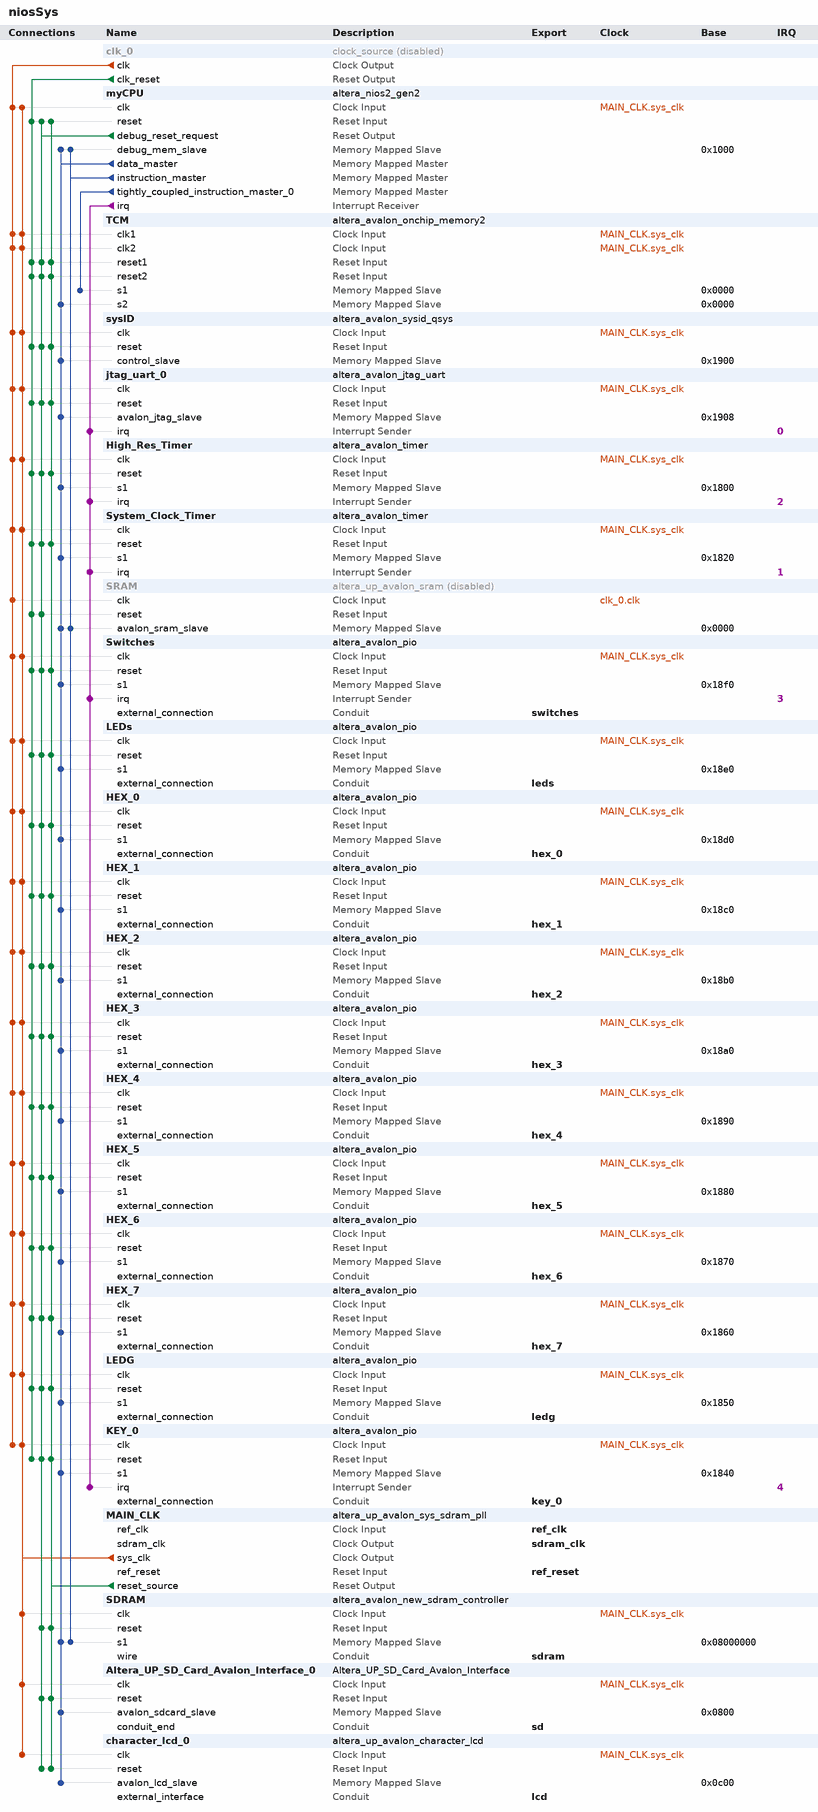
[diagram p0: system contents]
# Platform Designer (Qsys) system niosSys, Cyclone IV E EP4CE115F29C7
# Parameters at their usual value, and those the tool derives, are not listed.
package require -exact qsys 16.1
create_system niosSys
set_project_property DEVICE_FAMILY {Cyclone IV E}
set_project_property DEVICE EP4CE115F29C7

add_instance clk_0 clock_source 16.1
set_instance_property clk_0 ENABLED false
set_instance_parameter_value clk_0 clockFrequency 50000000

add_instance myCPU altera_nios2_gen2 16.1
set_instance_parameter_value myCPU dcache_size 2048
set_instance_parameter_value myCPU exceptionSlave SDRAM.s1
set_instance_parameter_value myCPU icache_numTCIM 1
set_instance_parameter_value myCPU icache_size 4096
set_instance_parameter_value myCPU impl Fast
set_instance_parameter_value myCPU resetSlave SDRAM.s1

add_instance TCM altera_avalon_onchip_memory2 16.1
set_instance_parameter_value TCM dataWidth 32
set_instance_parameter_value TCM dualPort true
set_instance_parameter_value TCM enableDiffWidth true
set_instance_parameter_value TCM initMemContent true
set_instance_parameter_value TCM initializationFileName onchip_mem.hex
set_instance_parameter_value TCM memorySize 2048

add_instance sysID altera_avalon_sysid_qsys 16.1
set_instance_parameter_value sysID id 305419896

add_instance jtag_uart_0 altera_avalon_jtag_uart 16.1
set_instance_parameter_value jtag_uart_0 simInteractiveOptions NO_INTERACTIVE_WINDOWS

add_instance High_Res_Timer altera_avalon_timer 16.1
set_instance_parameter_value High_Res_Timer period 1
set_instance_parameter_value High_Res_Timer periodUnits MSEC

add_instance System_Clock_Timer altera_avalon_timer 16.1
set_instance_parameter_value System_Clock_Timer period 1
set_instance_parameter_value System_Clock_Timer periodUnits MSEC

add_instance SRAM altera_up_avalon_sram 16.1
set_instance_property SRAM ENABLED false
set_instance_parameter_value SRAM board DE2-115
set_instance_parameter_value SRAM pixel_buffer false

add_instance Switches altera_avalon_pio 16.1
set_instance_parameter_value Switches direction Input
set_instance_parameter_value Switches generateIRQ true
set_instance_parameter_value Switches width 18

add_instance LEDs altera_avalon_pio 16.1
set_instance_parameter_value LEDs direction Output
set_instance_parameter_value LEDs width 18

add_instance HEX_0 altera_avalon_pio 16.1
set_instance_parameter_value HEX_0 direction Output
set_instance_parameter_value HEX_0 width 7

add_instance HEX_1 altera_avalon_pio 16.1
set_instance_parameter_value HEX_1 direction Output
set_instance_parameter_value HEX_1 width 7

add_instance HEX_2 altera_avalon_pio 16.1
set_instance_parameter_value HEX_2 direction Output
set_instance_parameter_value HEX_2 width 7

add_instance HEX_3 altera_avalon_pio 16.1
set_instance_parameter_value HEX_3 direction Output
set_instance_parameter_value HEX_3 width 7

add_instance HEX_4 altera_avalon_pio 16.1
set_instance_parameter_value HEX_4 direction Output
set_instance_parameter_value HEX_4 width 7

add_instance HEX_5 altera_avalon_pio 16.1
set_instance_parameter_value HEX_5 direction Output
set_instance_parameter_value HEX_5 width 7

add_instance HEX_6 altera_avalon_pio 16.1
set_instance_parameter_value HEX_6 direction Output
set_instance_parameter_value HEX_6 width 7

add_instance HEX_7 altera_avalon_pio 16.1
set_instance_parameter_value HEX_7 direction Output
set_instance_parameter_value HEX_7 width 7

add_instance LEDG altera_avalon_pio 16.1
set_instance_parameter_value LEDG direction Output
set_instance_parameter_value LEDG width 8

add_instance KEY_0 altera_avalon_pio 16.1
set_instance_parameter_value KEY_0 captureEdge true
set_instance_parameter_value KEY_0 direction Input
set_instance_parameter_value KEY_0 edgeType FALLING
set_instance_parameter_value KEY_0 generateIRQ true
set_instance_parameter_value KEY_0 irqType EDGE
set_instance_parameter_value KEY_0 width 4

add_instance MAIN_CLK altera_up_avalon_sys_sdram_pll 16.1
set_instance_parameter_value MAIN_CLK CV_boards DE1-SoC
set_instance_parameter_value MAIN_CLK gui_outclk 50.0
set_instance_parameter_value MAIN_CLK gui_refclk 50.0

add_instance SDRAM altera_avalon_new_sdram_controller 16.1
set_instance_parameter_value SDRAM TAC 5.4
set_instance_parameter_value SDRAM TRCD 15.0
set_instance_parameter_value SDRAM TRP 15.0
set_instance_parameter_value SDRAM casLatency 3
set_instance_parameter_value SDRAM columnWidth 10
set_instance_parameter_value SDRAM dataWidth 32
set_instance_parameter_value SDRAM generateSimulationModel false
set_instance_parameter_value SDRAM model single_Micron_MT48LC4M32B2_7_chip
set_instance_parameter_value SDRAM numberOfBanks 4
set_instance_parameter_value SDRAM numberOfChipSelects 1
set_instance_parameter_value SDRAM powerUpDelay 100.0
set_instance_parameter_value SDRAM refreshPeriod 7.185
set_instance_parameter_value SDRAM rowWidth 13

add_instance Altera_UP_SD_Card_Avalon_Interface_0 Altera_UP_SD_Card_Avalon_Interface 16.1

add_instance character_lcd_0 altera_up_avalon_character_lcd 16.1
set_instance_parameter_value character_lcd_0 cursor Blinking

# connections
add_connection clk_0.clk HEX_0.clk clock
add_connection clk_0.clk HEX_1.clk clock
add_connection clk_0.clk HEX_2.clk clock
add_connection clk_0.clk HEX_3.clk clock
add_connection clk_0.clk HEX_4.clk clock
add_connection clk_0.clk HEX_5.clk clock
add_connection clk_0.clk HEX_6.clk clock
add_connection clk_0.clk HEX_7.clk clock
add_connection clk_0.clk High_Res_Timer.clk clock
add_connection clk_0.clk jtag_uart_0.clk clock
add_connection clk_0.clk KEY_0.clk clock
add_connection clk_0.clk LEDG.clk clock
add_connection clk_0.clk LEDs.clk clock
add_connection clk_0.clk myCPU.clk clock
add_connection clk_0.clk SRAM.clk clock
add_connection clk_0.clk Switches.clk clock
add_connection clk_0.clk sysID.clk clock
add_connection clk_0.clk System_Clock_Timer.clk clock
add_connection clk_0.clk TCM.clk1 clock
add_connection clk_0.clk TCM.clk2 clock
add_connection MAIN_CLK.sys_clk Altera_UP_SD_Card_Avalon_Interface_0.clk clock
add_connection MAIN_CLK.sys_clk character_lcd_0.clk clock
add_connection MAIN_CLK.sys_clk HEX_0.clk clock
add_connection MAIN_CLK.sys_clk HEX_1.clk clock
add_connection MAIN_CLK.sys_clk HEX_2.clk clock
add_connection MAIN_CLK.sys_clk HEX_3.clk clock
add_connection MAIN_CLK.sys_clk HEX_4.clk clock
add_connection MAIN_CLK.sys_clk HEX_5.clk clock
add_connection MAIN_CLK.sys_clk HEX_6.clk clock
add_connection MAIN_CLK.sys_clk HEX_7.clk clock
add_connection MAIN_CLK.sys_clk High_Res_Timer.clk clock
add_connection MAIN_CLK.sys_clk jtag_uart_0.clk clock
add_connection MAIN_CLK.sys_clk KEY_0.clk clock
add_connection MAIN_CLK.sys_clk LEDG.clk clock
add_connection MAIN_CLK.sys_clk LEDs.clk clock
add_connection MAIN_CLK.sys_clk myCPU.clk clock
add_connection MAIN_CLK.sys_clk SDRAM.clk clock
add_connection MAIN_CLK.sys_clk Switches.clk clock
add_connection MAIN_CLK.sys_clk sysID.clk clock
add_connection MAIN_CLK.sys_clk System_Clock_Timer.clk clock
add_connection MAIN_CLK.sys_clk TCM.clk1 clock
add_connection MAIN_CLK.sys_clk TCM.clk2 clock
add_connection clk_0.clk_reset HEX_0.reset reset
add_connection clk_0.clk_reset HEX_1.reset reset
add_connection clk_0.clk_reset HEX_2.reset reset
add_connection clk_0.clk_reset HEX_3.reset reset
add_connection clk_0.clk_reset HEX_4.reset reset
add_connection clk_0.clk_reset HEX_5.reset reset
add_connection clk_0.clk_reset HEX_6.reset reset
add_connection clk_0.clk_reset HEX_7.reset reset
add_connection clk_0.clk_reset High_Res_Timer.reset reset
add_connection clk_0.clk_reset jtag_uart_0.reset reset
add_connection clk_0.clk_reset KEY_0.reset reset
add_connection clk_0.clk_reset LEDG.reset reset
add_connection clk_0.clk_reset LEDs.reset reset
add_connection clk_0.clk_reset myCPU.reset reset
add_connection clk_0.clk_reset SRAM.reset reset
add_connection clk_0.clk_reset Switches.reset reset
add_connection clk_0.clk_reset sysID.reset reset
add_connection clk_0.clk_reset System_Clock_Timer.reset reset
add_connection clk_0.clk_reset TCM.reset1 reset
add_connection clk_0.clk_reset TCM.reset2 reset
add_connection MAIN_CLK.reset_source Altera_UP_SD_Card_Avalon_Interface_0.reset reset
add_connection MAIN_CLK.reset_source character_lcd_0.reset reset
add_connection MAIN_CLK.reset_source HEX_0.reset reset
add_connection MAIN_CLK.reset_source HEX_1.reset reset
add_connection MAIN_CLK.reset_source HEX_2.reset reset
add_connection MAIN_CLK.reset_source HEX_3.reset reset
add_connection MAIN_CLK.reset_source HEX_4.reset reset
add_connection MAIN_CLK.reset_source HEX_5.reset reset
add_connection MAIN_CLK.reset_source HEX_6.reset reset
add_connection MAIN_CLK.reset_source HEX_7.reset reset
add_connection MAIN_CLK.reset_source High_Res_Timer.reset reset
add_connection MAIN_CLK.reset_source jtag_uart_0.reset reset
add_connection MAIN_CLK.reset_source KEY_0.reset reset
add_connection MAIN_CLK.reset_source LEDG.reset reset
add_connection MAIN_CLK.reset_source LEDs.reset reset
add_connection MAIN_CLK.reset_source myCPU.reset reset
add_connection MAIN_CLK.reset_source SDRAM.reset reset
add_connection MAIN_CLK.reset_source Switches.reset reset
add_connection MAIN_CLK.reset_source sysID.reset reset
add_connection MAIN_CLK.reset_source System_Clock_Timer.reset reset
add_connection MAIN_CLK.reset_source TCM.reset1 reset
add_connection MAIN_CLK.reset_source TCM.reset2 reset
add_connection myCPU.debug_reset_request Altera_UP_SD_Card_Avalon_Interface_0.reset reset
add_connection myCPU.debug_reset_request character_lcd_0.reset reset
add_connection myCPU.debug_reset_request HEX_0.reset reset
add_connection myCPU.debug_reset_request HEX_1.reset reset
add_connection myCPU.debug_reset_request HEX_2.reset reset
add_connection myCPU.debug_reset_request HEX_3.reset reset
add_connection myCPU.debug_reset_request HEX_4.reset reset
add_connection myCPU.debug_reset_request HEX_5.reset reset
add_connection myCPU.debug_reset_request HEX_6.reset reset
add_connection myCPU.debug_reset_request HEX_7.reset reset
add_connection myCPU.debug_reset_request High_Res_Timer.reset reset
add_connection myCPU.debug_reset_request jtag_uart_0.reset reset
add_connection myCPU.debug_reset_request KEY_0.reset reset
add_connection myCPU.debug_reset_request LEDG.reset reset
add_connection myCPU.debug_reset_request LEDs.reset reset
add_connection myCPU.debug_reset_request myCPU.reset reset
add_connection myCPU.debug_reset_request SDRAM.reset reset
add_connection myCPU.debug_reset_request SRAM.reset reset
add_connection myCPU.debug_reset_request Switches.reset reset
add_connection myCPU.debug_reset_request sysID.reset reset
add_connection myCPU.debug_reset_request System_Clock_Timer.reset reset
add_connection myCPU.debug_reset_request TCM.reset1 reset
add_connection myCPU.debug_reset_request TCM.reset2 reset
add_connection myCPU.data_master Altera_UP_SD_Card_Avalon_Interface_0.avalon_sdcard_slave avalon
set_connection_parameter_value myCPU.data_master/Altera_UP_SD_Card_Avalon_Interface_0.avalon_sdcard_slave baseAddress 0x0800
add_connection myCPU.data_master character_lcd_0.avalon_lcd_slave avalon
set_connection_parameter_value myCPU.data_master/character_lcd_0.avalon_lcd_slave baseAddress 0x0c00
add_connection myCPU.data_master HEX_0.s1 avalon
set_connection_parameter_value myCPU.data_master/HEX_0.s1 baseAddress 0x18d0
add_connection myCPU.data_master HEX_1.s1 avalon
set_connection_parameter_value myCPU.data_master/HEX_1.s1 baseAddress 0x18c0
add_connection myCPU.data_master HEX_2.s1 avalon
set_connection_parameter_value myCPU.data_master/HEX_2.s1 baseAddress 0x18b0
add_connection myCPU.data_master HEX_3.s1 avalon
set_connection_parameter_value myCPU.data_master/HEX_3.s1 baseAddress 0x18a0
add_connection myCPU.data_master HEX_4.s1 avalon
set_connection_parameter_value myCPU.data_master/HEX_4.s1 baseAddress 0x1890
add_connection myCPU.data_master HEX_5.s1 avalon
set_connection_parameter_value myCPU.data_master/HEX_5.s1 baseAddress 0x1880
add_connection myCPU.data_master HEX_6.s1 avalon
set_connection_parameter_value myCPU.data_master/HEX_6.s1 baseAddress 0x1870
add_connection myCPU.data_master HEX_7.s1 avalon
set_connection_parameter_value myCPU.data_master/HEX_7.s1 baseAddress 0x1860
add_connection myCPU.data_master High_Res_Timer.s1 avalon
set_connection_parameter_value myCPU.data_master/High_Res_Timer.s1 baseAddress 0x1800
add_connection myCPU.data_master jtag_uart_0.avalon_jtag_slave avalon
set_connection_parameter_value myCPU.data_master/jtag_uart_0.avalon_jtag_slave baseAddress 0x1908
add_connection myCPU.data_master KEY_0.s1 avalon
set_connection_parameter_value myCPU.data_master/KEY_0.s1 baseAddress 0x1840
add_connection myCPU.data_master LEDG.s1 avalon
set_connection_parameter_value myCPU.data_master/LEDG.s1 baseAddress 0x1850
add_connection myCPU.data_master LEDs.s1 avalon
set_connection_parameter_value myCPU.data_master/LEDs.s1 baseAddress 0x18e0
add_connection myCPU.data_master myCPU.debug_mem_slave avalon
set_connection_parameter_value myCPU.data_master/myCPU.debug_mem_slave baseAddress 0x1000
add_connection myCPU.data_master SDRAM.s1 avalon
set_connection_parameter_value myCPU.data_master/SDRAM.s1 baseAddress 0x08000000
add_connection myCPU.data_master SRAM.avalon_sram_slave avalon
set_connection_parameter_value myCPU.data_master/SRAM.avalon_sram_slave baseAddress 0x0000
add_connection myCPU.data_master Switches.s1 avalon
set_connection_parameter_value myCPU.data_master/Switches.s1 baseAddress 0x18f0
add_connection myCPU.data_master sysID.control_slave avalon
set_connection_parameter_value myCPU.data_master/sysID.control_slave baseAddress 0x1900
add_connection myCPU.data_master System_Clock_Timer.s1 avalon
set_connection_parameter_value myCPU.data_master/System_Clock_Timer.s1 baseAddress 0x1820
add_connection myCPU.data_master TCM.s2 avalon
set_connection_parameter_value myCPU.data_master/TCM.s2 baseAddress 0x0000
add_connection myCPU.instruction_master myCPU.debug_mem_slave avalon
set_connection_parameter_value myCPU.instruction_master/myCPU.debug_mem_slave baseAddress 0x1000
add_connection myCPU.instruction_master SDRAM.s1 avalon
set_connection_parameter_value myCPU.instruction_master/SDRAM.s1 baseAddress 0x08000000
add_connection myCPU.instruction_master SRAM.avalon_sram_slave avalon
set_connection_parameter_value myCPU.instruction_master/SRAM.avalon_sram_slave baseAddress 0x0000
add_connection myCPU.tightly_coupled_instruction_master_0 TCM.s1 avalon
set_connection_parameter_value myCPU.tightly_coupled_instruction_master_0/TCM.s1 baseAddress 0x0000
add_connection myCPU.irq High_Res_Timer.irq interrupt
set_connection_parameter_value myCPU.irq/High_Res_Timer.irq irqNumber 2
add_connection myCPU.irq jtag_uart_0.irq interrupt
set_connection_parameter_value myCPU.irq/jtag_uart_0.irq irqNumber 0
add_connection myCPU.irq KEY_0.irq interrupt
set_connection_parameter_value myCPU.irq/KEY_0.irq irqNumber 4
add_connection myCPU.irq Switches.irq interrupt
set_connection_parameter_value myCPU.irq/Switches.irq irqNumber 3
add_connection myCPU.irq System_Clock_Timer.irq interrupt
set_connection_parameter_value myCPU.irq/System_Clock_Timer.irq irqNumber 1

# exported interfaces
add_interface hex_0 conduit end
set_interface_property hex_0 EXPORT_OF HEX_0.external_connection
add_interface hex_1 conduit end
set_interface_property hex_1 EXPORT_OF HEX_1.external_connection
add_interface hex_2 conduit end
set_interface_property hex_2 EXPORT_OF HEX_2.external_connection
add_interface hex_3 conduit end
set_interface_property hex_3 EXPORT_OF HEX_3.external_connection
add_interface hex_4 conduit end
set_interface_property hex_4 EXPORT_OF HEX_4.external_connection
add_interface hex_5 conduit end
set_interface_property hex_5 EXPORT_OF HEX_5.external_connection
add_interface hex_6 conduit end
set_interface_property hex_6 EXPORT_OF HEX_6.external_connection
add_interface hex_7 conduit end
set_interface_property hex_7 EXPORT_OF HEX_7.external_connection
add_interface key_0 conduit end
set_interface_property key_0 EXPORT_OF KEY_0.external_connection
add_interface lcd conduit end
set_interface_property lcd EXPORT_OF character_lcd_0.external_interface
add_interface ledg conduit end
set_interface_property ledg EXPORT_OF LEDG.external_connection
add_interface leds conduit end
set_interface_property leds EXPORT_OF LEDs.external_connection
add_interface ref_clk clock sink
set_interface_property ref_clk EXPORT_OF MAIN_CLK.ref_clk
add_interface ref_reset reset sink
set_interface_property ref_reset EXPORT_OF MAIN_CLK.ref_reset
add_interface sd conduit end
set_interface_property sd EXPORT_OF Altera_UP_SD_Card_Avalon_Interface_0.conduit_end
add_interface sdram conduit end
set_interface_property sdram EXPORT_OF SDRAM.wire
add_interface sdram_clk clock source
set_interface_property sdram_clk EXPORT_OF MAIN_CLK.sdram_clk
add_interface switches conduit end
set_interface_property switches EXPORT_OF Switches.external_connection

set_interconnect_requirement {$system} qsys_mm.clockCrossingAdapter HANDSHAKE
set_interconnect_requirement {$system} qsys_mm.enableEccProtection FALSE
set_interconnect_requirement {$system} qsys_mm.insertDefaultSlave FALSE
set_interconnect_requirement {$system} qsys_mm.maxAdditionalLatency 1

save_system niosSys.qsys
